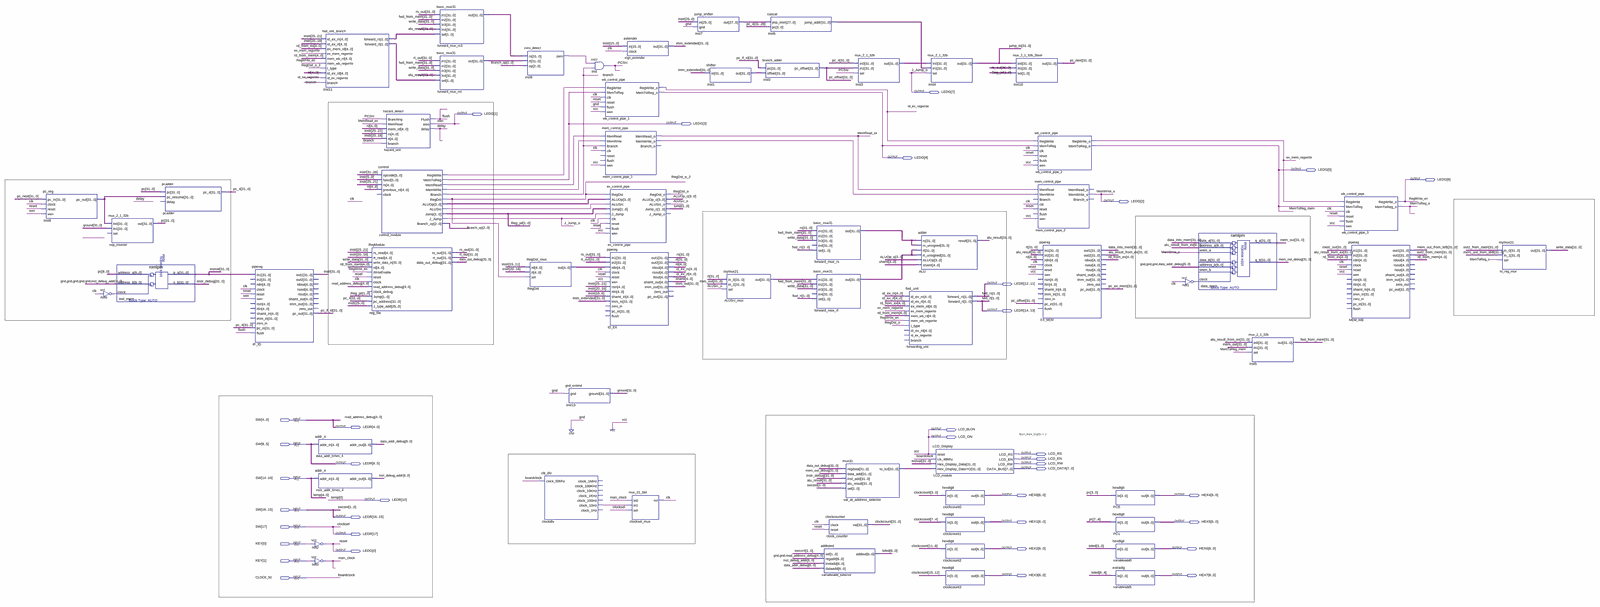
[diagram p0: schematic sheet, whole]
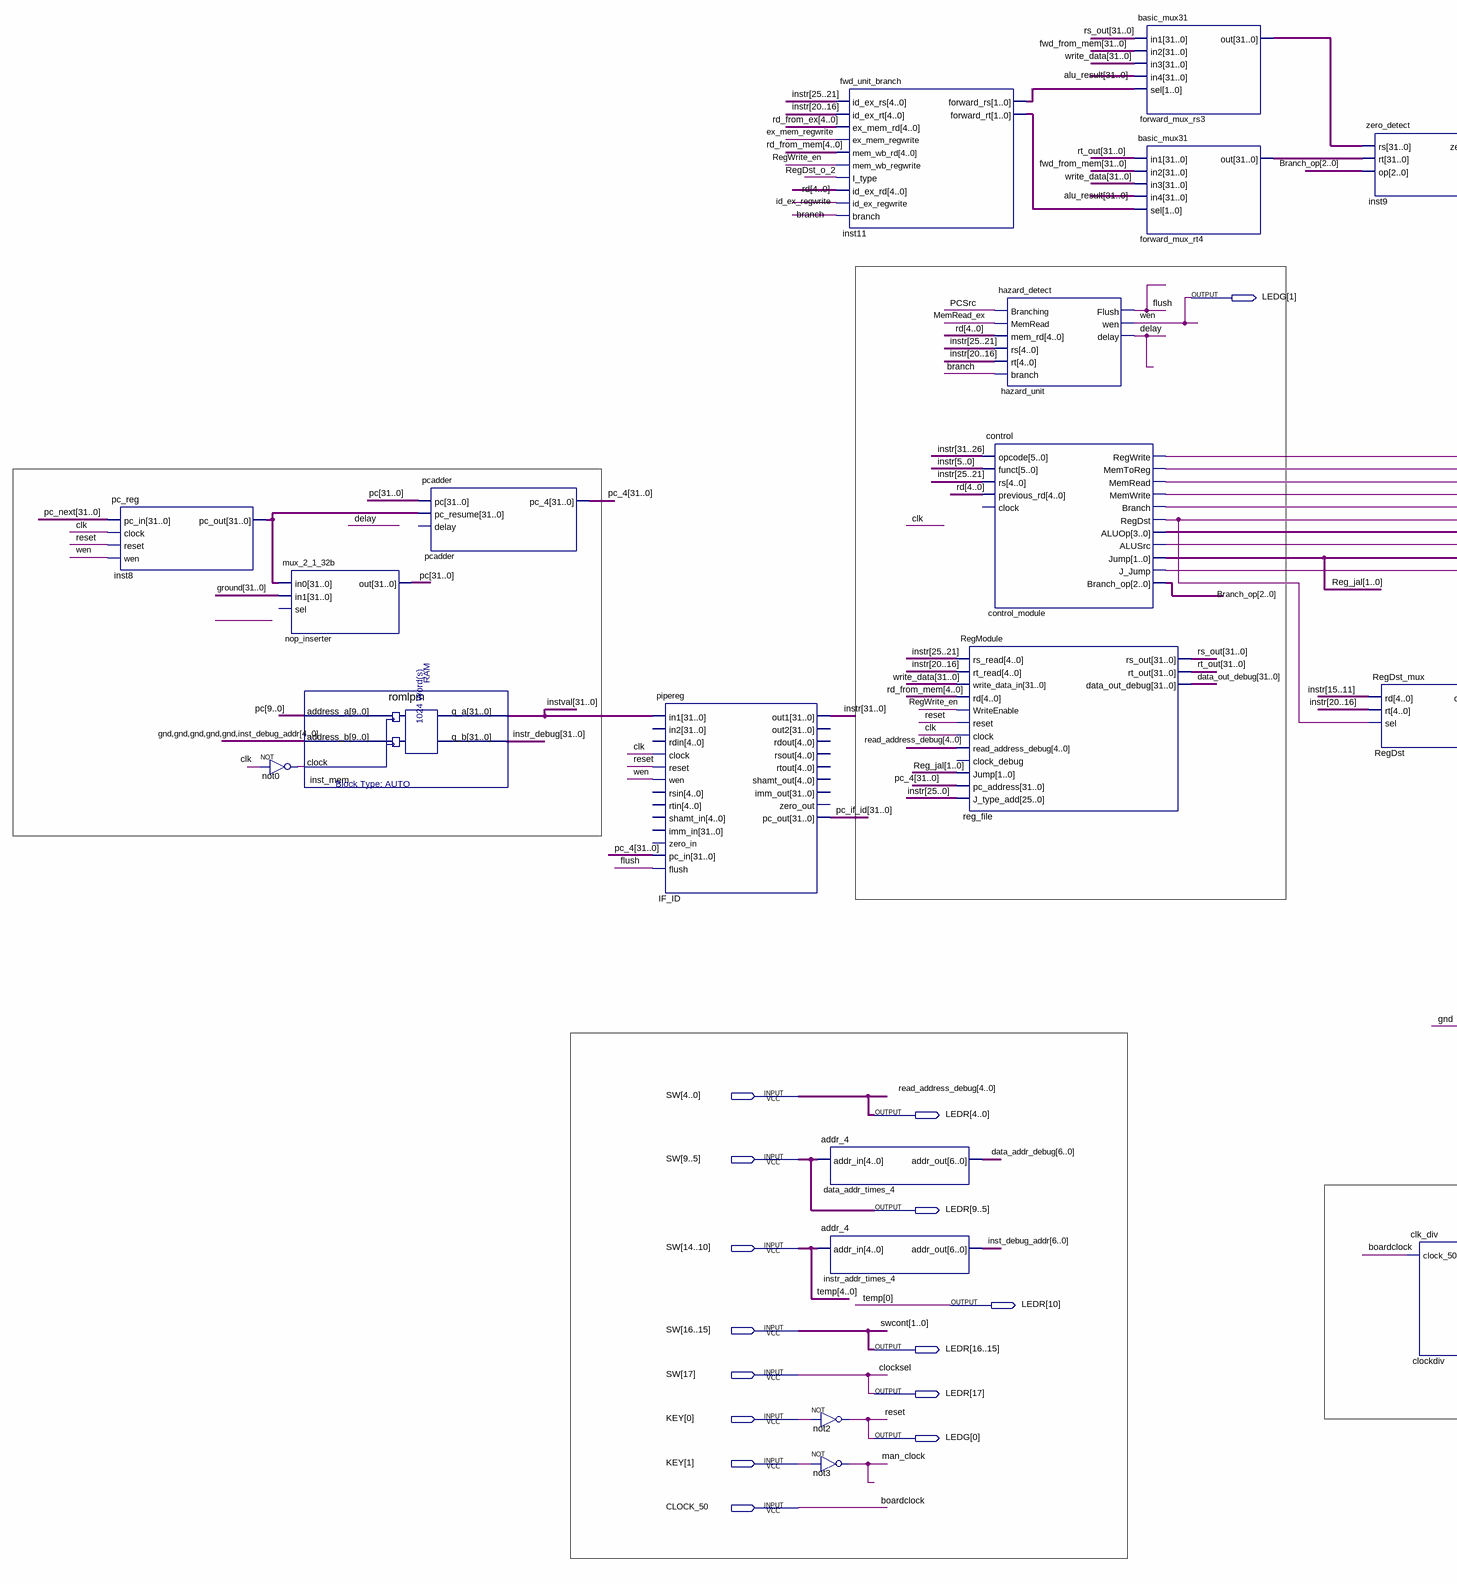
[diagram p1: schematic sheet, left part]
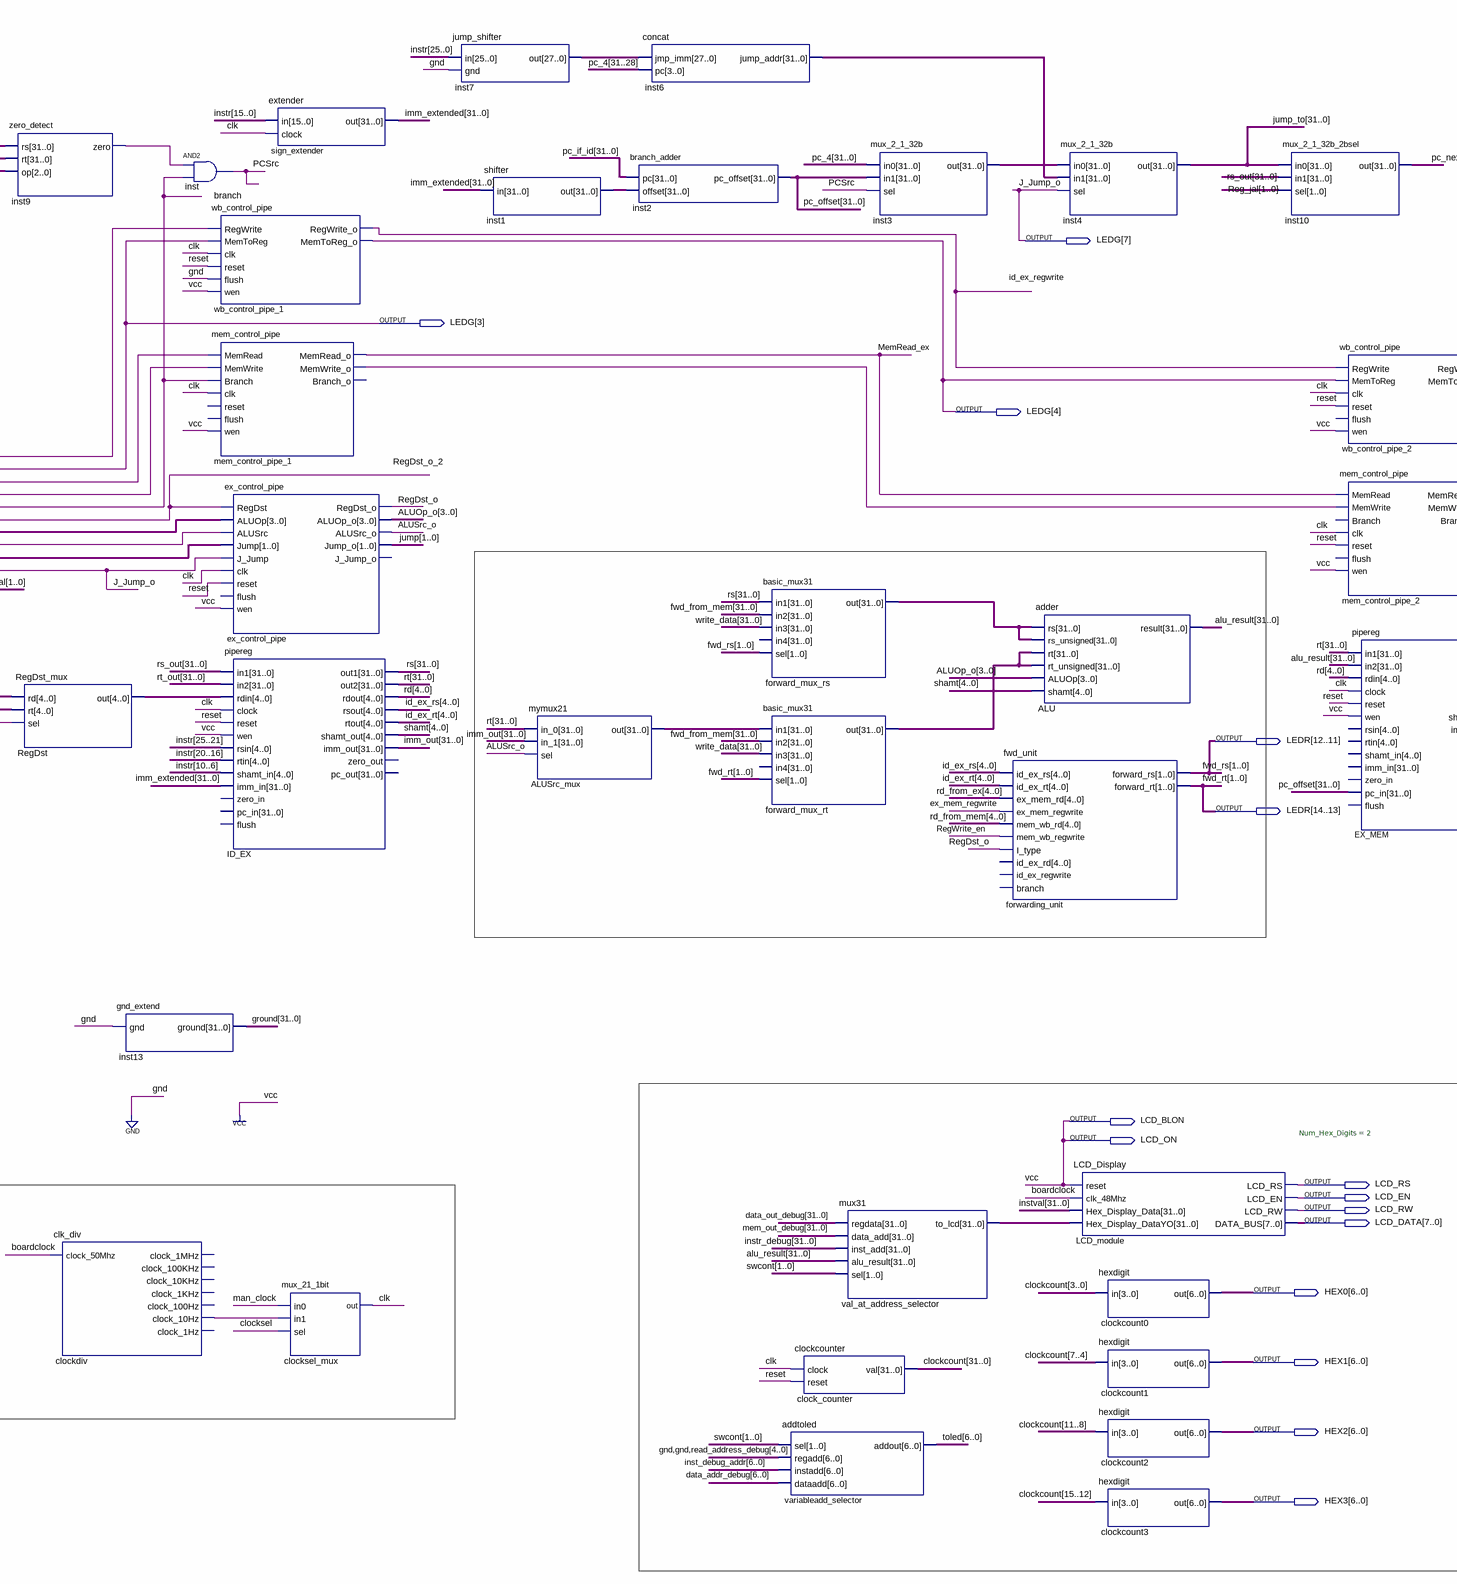
[diagram p2: schematic sheet, centre part]
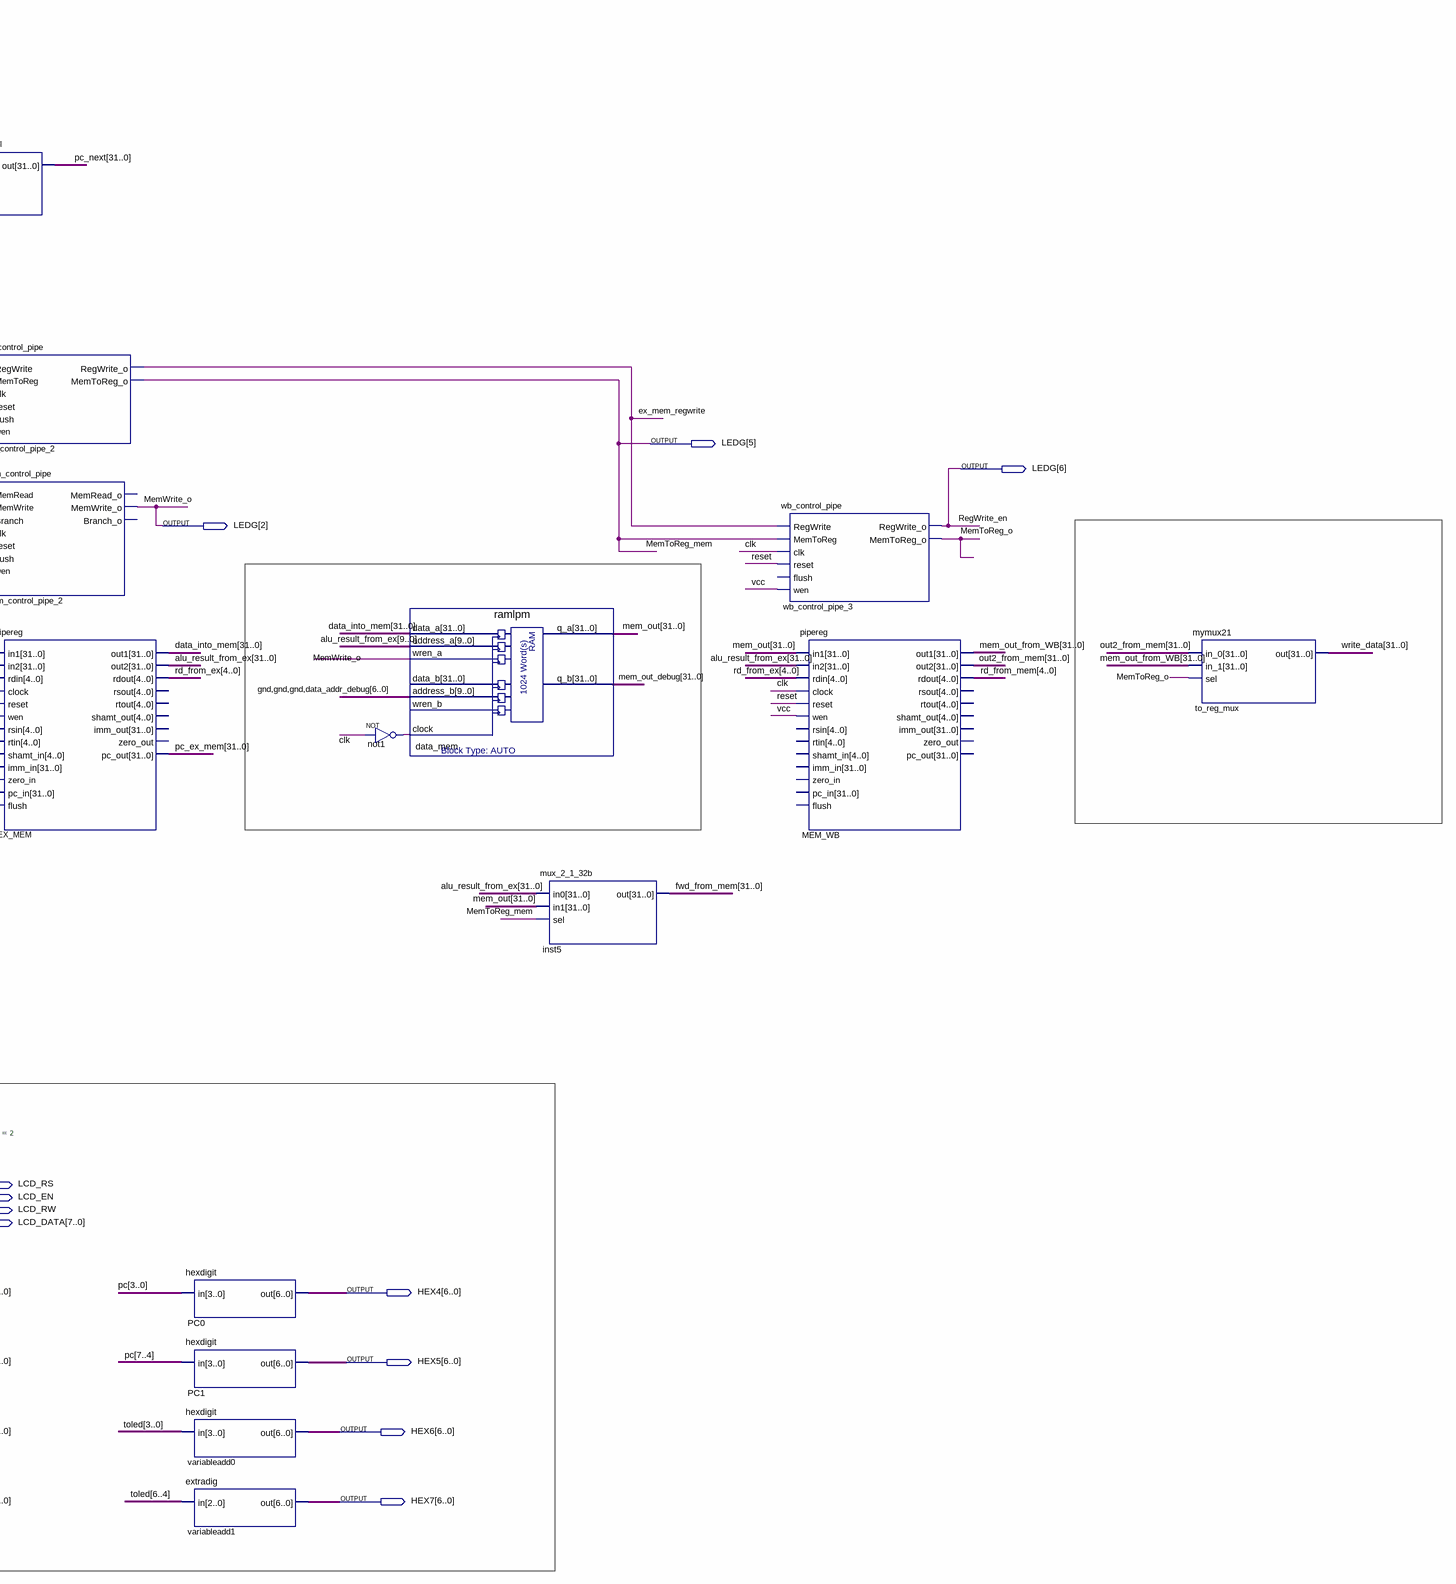
[diagram p3: schematic sheet, right part]
// Quartus schematic RegFile.bdf as structural Verilog: 60 symbols, 37 pins
module RegFile (
  input  [17:0] SW,
  input  [1:0] KEY,
  input  CLOCK_50,
  output [7:0] LEDG,
  output [17:0] LEDR,
  output LCD_BLON,
  output LCD_ON,
  output LCD_RS,
  output LCD_EN,
  output LCD_RW,
  output [7:0] LCD_DATA,
  output [6:0] HEX0,
  output [6:0] HEX4,
  output [6:0] HEX1,
  output [6:0] HEX5,
  output [6:0] HEX2,
  output [6:0] HEX6,
  output [6:0] HEX3,
  output [6:0] HEX7
);

  wire ALUSrc_o, branch, clk, clockdiv_clock_10hz, control_module_alusrc, control_module_memread,
       control_module_memwrite, control_module_regwrite, delay, ex_mem_regwrite, flush, id_ex_regwrite,
       inst9_zero, man_clock, mem_control_pipe_1_memwrite_o, MemRead_ex, MemToReg_o, not0_out, not1_out,
       PCSrc, RegDst_o, RegDst_o_2;
  wire [1:0] inst11_forward_rs, inst11_forward_rt, jump, Reg_jal;
  wire [2:0] Branch_op;
  wire [3:0] ALUOp_o, control_module_aluop;
  wire [4:0] id_ex_rs, id_ex_rt, rd, rd_from_ex, rd_from_mem, RegDst_out, shamt;
  wire [6:0] data_addr_debug, inst_debug_addr, toled;
  wire [27:0] inst7_out;
  wire [31:0] alu_result, alu_result_from_ex, ALUSrc_mux_out, clockcount, data_into_mem, data_out_debug,
       forward_mux_rs3_out, forward_mux_rs_out, forward_mux_rt4_out, forward_mux_rt_out, fwd_from_mem,
       ground, imm_extended, imm_out, inst1_out, inst3_out, inst6_jump_addr, inst8_pc_out, instr,
       instr_debug, instval, jump_to, mem_out, mem_out_debug, mem_out_from_WB, out2_from_mem, pc, pc_4,
       pc_ex_mem, pc_if_id, pc_next, pc_offset, rs, rs_out, rt, rt_out, val_at_address_selector_to_lcd,
       write_data;

  pc_reg inst8 (.pc_in(pc_next), .clock(clk), .reset(LEDG[0]), .wen(LEDG[1]), .pc_out(inst8_pc_out));
  mux_2_1_32b nop_inserter (.in0(inst8_pc_out), .in1(ground), .out(pc));  // open: sel
  not not0 (not0_out, clk);
  romlpm inst_mem (
    .address_a(pc[9:0]), .address_b({{5{1'b0}}, inst_debug_addr[4:0]}), .clock(not0_out), .q_a(instval),
    .q_b(instr_debug));
  pcadder pcadder (.pc(pc), .pc_resume(inst8_pc_out), .pc_4(pc_4));  // open: delay
  pipereg IF_ID (
    .in1(instval), .clock(clk), .reset(LEDG[0]), .wen(LEDG[1]), .pc_in(pc_4), .flush(flush), .out1(instr),
    .pc_out(pc_if_id));  // open: in2, rdin, rsin, rtin, shamt_in, imm_in, zero_in, out2, rdout, rsout, rtout, shamt_out, imm_out, zero_out
  fwd_unit_branch inst11 (
    .id_ex_rs(instr[25:21]), .id_ex_rt(instr[20:16]), .ex_mem_rd(rd_from_ex),
    .ex_mem_regwrite(ex_mem_regwrite), .mem_wb_rd(rd_from_mem), .mem_wb_regwrite(LEDG[6]),
    .I_type(RegDst_o_2), .id_ex_rd(rd), .id_ex_regwrite(id_ex_regwrite), .branch(branch),
    .forward_rs(inst11_forward_rs), .forward_rt(inst11_forward_rt));
  addr_4 data_addr_times_4 (.addr_in(SW[9:5]), .addr_out(data_addr_debug));
  addr_4 instr_addr_times_4 (.addr_in(SW[14:10]), .addr_out(inst_debug_addr));
  not not2 (LEDG[0], KEY[0]);
  not not3 (man_clock, KEY[1]);
  hazard_detect hazard_unit (
    .Branching(PCSrc), .MemRead(MemRead_ex), .mem_rd(rd), .rs(instr[25:21]), .rt(instr[20:16]),
    .branch(branch), .Flush(flush), .wen(LEDG[1]), .delay(delay));
  control control_module (
    .opcode(instr[31:26]), .funct(instr[5:0]), .rs(instr[25:21]), .previous_rd(rd),
    .RegWrite(control_module_regwrite), .MemToReg(LEDG[3]), .MemRead(control_module_memread),
    .MemWrite(control_module_memwrite), .Branch(branch), .RegDst(RegDst_o_2), .ALUOp(control_module_aluop),
    .ALUSrc(control_module_alusrc), .Jump(Reg_jal), .J_Jump(LEDG[7]), .Branch_op(Branch_op));  // open: clock
  RegModule reg_file (
    .rs_read(instr[25:21]), .rt_read(instr[20:16]), .write_data_in(write_data), .rd(rd_from_mem),
    .WriteEnable(LEDG[6]), .reset(LEDG[0]), .clock(clk), .read_address_debug(SW[4:0]), .Jump(Reg_jal),
    .pc_address(pc_4), .J_type_add(instr[25:0]), .rs_out(rs_out), .rt_out(rt_out),
    .data_out_debug(data_out_debug));  // open: clock_debug
  basic_mux31 forward_mux_rs3 (
    .in1(rs_out), .in2(fwd_from_mem), .in3(write_data), .in4(alu_result), .sel(inst11_forward_rs),
    .out(forward_mux_rs3_out));
  basic_mux31 forward_mux_rt4 (
    .in1(rt_out), .in2(fwd_from_mem), .in3(write_data), .in4(alu_result), .sel(inst11_forward_rt),
    .out(forward_mux_rt4_out));
  zero_detect inst9 (.rs(forward_mux_rs3_out), .rt(forward_mux_rt4_out), .op(Branch_op), .zero(inst9_zero));
  RegDst_mux RegDst (.rd(instr[15:11]), .rt(instr[20:16]), .sel(RegDst_o_2), .out(RegDst_out));
  clk_div clockdiv (
    .clock_50Mhz(CLOCK_50), .clock_10Hz(clockdiv_clock_10hz));  // open: clock_1MHz, clock_100KHz, clock_10KHz, clock_1KHz, clock_100Hz, clock_1Hz
  gnd_extend inst13 (.gnd(1'b0), .ground(ground));
  and inst (PCSrc, inst9_zero, branch);
  wb_control_pipe wb_control_pipe_1 (
    .RegWrite(control_module_regwrite), .MemToReg(LEDG[3]), .clk(clk), .reset(LEDG[0]), .flush(1'b0),
    .wen(1'b1), .RegWrite_o(id_ex_regwrite), .MemToReg_o(LEDG[4]));
  mem_control_pipe mem_control_pipe_1 (
    .MemRead(control_module_memread), .MemWrite(control_module_memwrite), .Branch(branch), .clk(clk),
    .wen(1'b1), .MemRead_o(MemRead_ex), .MemWrite_o(mem_control_pipe_1_memwrite_o));  // open: reset, flush, Branch_o
  ex_control_pipe ex_control_pipe (
    .RegDst(RegDst_o_2), .ALUOp(control_module_aluop), .ALUSrc(control_module_alusrc), .Jump(Reg_jal),
    .J_Jump(LEDG[7]), .clk(clk), .reset(LEDG[0]), .wen(1'b1), .RegDst_o(RegDst_o), .ALUOp_o(ALUOp_o),
    .ALUSrc_o(ALUSrc_o), .Jump_o(jump));  // open: flush, J_Jump_o
  pipereg ID_EX (
    .in1(rs_out), .in2(rt_out), .rdin(RegDst_out), .clock(clk), .reset(LEDG[0]), .wen(1'b1),
    .rsin(instr[25:21]), .rtin(instr[20:16]), .shamt_in(instr[10:6]), .imm_in(imm_extended), .out1(rs),
    .out2(rt), .rdout(rd), .rsout(id_ex_rs), .rtout(id_ex_rt), .shamt_out(shamt), .imm_out(imm_out));  // open: zero_in, pc_in, flush, zero_out, pc_out
  extender sign_extender (.in(instr[15:0]), .clock(clk), .out(imm_extended));
  mux_21_1bit clocksel_mux (.in0(man_clock), .in1(clockdiv_clock_10hz), .sel(SW[17]), .out(clk));
  jump_shifter inst7 (.in(instr[25:0]), .gnd(1'b0), .out(inst7_out));
  shifter inst1 (.in(imm_extended), .out(inst1_out));
  mymux21 ALUSrc_mux (.in_0(rt), .in_1(imm_out), .sel(ALUSrc_o), .out(ALUSrc_mux_out));
  concat inst6 (.jmp_imm(inst7_out), .pc(pc_4[31:28]), .jump_addr(inst6_jump_addr));
  branch_adder inst2 (.pc(pc_if_id), .offset(inst1_out), .pc_offset(pc_offset));
  basic_mux31 forward_mux_rs (
    .in1(rs), .in2(fwd_from_mem), .in3(write_data), .sel(LEDR[12:11]), .out(forward_mux_rs_out));  // open: in4
  basic_mux31 forward_mux_rt (
    .in1(ALUSrc_mux_out), .in2(fwd_from_mem), .in3(write_data), .sel(LEDR[14:13]), .out(forward_mux_rt_out));  // open: in4
  clockcounter clock_counter (.clock(clk), .reset(LEDG[0]), .val(clockcount));
  addtoled variableadd_selector (
    .sel(SW[16:15]), .regadd({2'b00, SW[4:0]}), .instadd(inst_debug_addr), .dataadd(data_addr_debug),
    .addout(toled));
  mux31 val_at_address_selector (
    .regdata(data_out_debug), .data_add(mem_out_debug), .inst_add(instr_debug), .alu_result(alu_result),
    .sel(SW[16:15]), .to_lcd(val_at_address_selector_to_lcd));
  mux_2_1_32b inst3 (.in0(pc_4), .in1(pc_offset), .sel(PCSrc), .out(inst3_out));
  fwd_unit forwarding_unit (
    .id_ex_rs(id_ex_rs), .id_ex_rt(id_ex_rt), .ex_mem_rd(rd_from_ex), .ex_mem_regwrite(ex_mem_regwrite),
    .mem_wb_rd(rd_from_mem), .mem_wb_regwrite(LEDG[6]), .I_type(RegDst_o), .forward_rs(LEDR[12:11]),
    .forward_rt(LEDR[14:13]));  // open: id_ex_rd, id_ex_regwrite, branch
  mux_2_1_32b inst4 (.in0(inst3_out), .in1(inst6_jump_addr), .sel(LEDG[7]), .out(jump_to));
  adder ALU (
    .rs(forward_mux_rs_out), .rs_unsigned(forward_mux_rs_out), .rt(forward_mux_rt_out),
    .rt_unsigned(forward_mux_rt_out), .ALUOp(ALUOp_o), .shamt(shamt), .result(alu_result));
  LCD_Display #(.Num_Hex_Digits(2)) LCD_module (
    .reset(1'b1), .clk_48Mhz(CLOCK_50), .Hex_Display_Data(instval),
    .Hex_Display_DataYO(val_at_address_selector_to_lcd), .LCD_RS(LCD_RS), .LCD_EN(LCD_EN), .LCD_RW(LCD_RW),
    .DATA_BUS(LCD_DATA));
  hexdigit clockcount0 (.in(clockcount[3:0]), .out(HEX0));
  hexdigit clockcount1 (.in(clockcount[7:4]), .out(HEX1));
  hexdigit clockcount2 (.in(clockcount[11:8]), .out(HEX2));
  hexdigit clockcount3 (.in(clockcount[15:12]), .out(HEX3));
  mux_2_1_32b_2bsel inst10 (.in0(jump_to), .in1(rs_out), .sel(Reg_jal), .out(pc_next));
  wb_control_pipe wb_control_pipe_2 (
    .RegWrite(id_ex_regwrite), .MemToReg(LEDG[4]), .clk(clk), .reset(LEDG[0]), .wen(1'b1),
    .RegWrite_o(ex_mem_regwrite), .MemToReg_o(LEDG[5]));  // open: flush
  mem_control_pipe mem_control_pipe_2 (
    .MemRead(MemRead_ex), .MemWrite(mem_control_pipe_1_memwrite_o), .clk(clk), .reset(LEDG[0]), .wen(1'b1),
    .MemWrite_o(LEDG[2]));  // open: Branch, flush, MemRead_o, Branch_o
  pipereg EX_MEM (
    .in1(rt), .in2(alu_result), .rdin(rd), .clock(clk), .reset(LEDG[0]), .wen(1'b1), .pc_in(pc_offset),
    .out1(data_into_mem), .out2(alu_result_from_ex), .rdout(rd_from_ex), .pc_out(pc_ex_mem));  // open: rsin, rtin, shamt_in, imm_in, zero_in, flush, rsout, rtout, shamt_out, imm_out, zero_out
  hexdigit PC0 (.in(pc[3:0]), .out(HEX4));
  hexdigit PC1 (.in(pc[7:4]), .out(HEX5));
  hexdigit variableadd0 (.in(toled[3:0]), .out(HEX6));
  extradig variableadd1 (.in(toled[6:4]), .out(HEX7));
  ramlpm data_mem (
    .data_a(data_into_mem), .address_a(alu_result_from_ex[9:0]), .wren_a(LEDG[2]),
    .address_b({3'b000, data_addr_debug}), .clock(not1_out), .q_a(mem_out), .q_b(mem_out_debug));  // open: data_b, wren_b
  not not1 (not1_out, clk);
  mux_2_1_32b inst5 (.in0(alu_result_from_ex), .in1(mem_out), .sel(LEDG[5]), .out(fwd_from_mem));
  wb_control_pipe wb_control_pipe_3 (
    .RegWrite(ex_mem_regwrite), .MemToReg(LEDG[5]), .clk(clk), .reset(LEDG[0]), .wen(1'b1),
    .RegWrite_o(LEDG[6]), .MemToReg_o(MemToReg_o));  // open: flush
  pipereg MEM_WB (
    .in1(mem_out), .in2(alu_result_from_ex), .rdin(rd_from_ex), .clock(clk), .reset(LEDG[0]), .wen(1'b1),
    .out1(mem_out_from_WB), .out2(out2_from_mem), .rdout(rd_from_mem));  // open: rsin, rtin, shamt_in, imm_in, zero_in, pc_in, flush, rsout, rtout, shamt_out, imm_out, zero_out, pc_out
  mymux21 to_reg_mux (.in_0(out2_from_mem), .in_1(mem_out_from_WB), .sel(MemToReg_o), .out(write_data));

  assign LCD_BLON = 1'b1;
  assign LCD_ON = 1'b1;
  assign {LEDR[17:15], LEDR[10:0]} = {SW[17:15], SW[10:0]};

  // Other names for the same wires on the sheet: boardclock = CLOCK_50; MemWrite_o = LEDG[2]; MemToReg_mem = LEDG[5];
  //   RegWrite_en = LEDG[6]; J_Jump_o = LEDG[7]; read_address_debug[4:0] = SW[4:0]; fwd_rs[1:0] = LEDR[12:11];
  //   fwd_rt[1:0] = LEDR[14:13]; swcont[1:0] = SW[16:15]; clocksel = SW[17]; reset = LEDG[0]; temp[4:0] = SW[14:10];
  //   wen = LEDG[1]
endmodule
